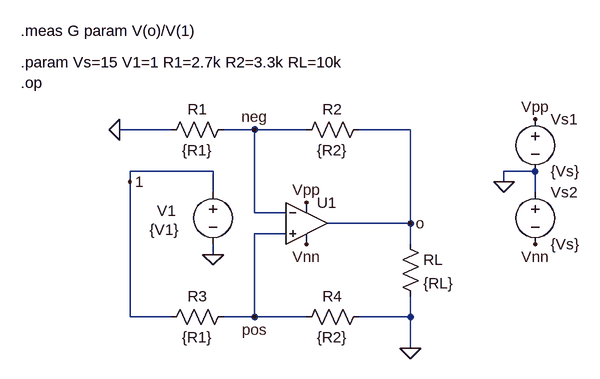
[diagram p0: schematic Amp05op.asc]
Amp05op.asc, the LTspice schematic file:
Version 4
SHEET 1 968 680
WIRE -48 80 -128 80
WIRE 80 80 32 80
WIRE 160 80 80 80
WIRE 320 80 240 80
WIRE 16 144 -112 144
WIRE 512 144 464 144
WIRE -112 160 -112 144
WIRE 464 160 464 144
WIRE 16 176 16 144
WIRE 512 176 512 144
WIRE 80 208 80 80
WIRE 128 208 80 208
WIRE 320 224 320 80
WIRE 320 224 192 224
WIRE 128 240 80 240
WIRE 320 256 320 224
WIRE 16 272 16 256
WIRE -112 368 -112 160
WIRE -48 368 -112 368
WIRE 80 368 80 240
WIRE 80 368 32 368
WIRE 160 368 80 368
WIRE 320 368 320 336
WIRE 320 368 240 368
WIRE 320 416 320 368
FLAG 512 64 Vpp
FLAG 464 160 0
FLAG 512 256 Vnn
FLAG 320 416 0
FLAG 160 192 Vpp
FLAG 160 256 Vnn
FLAG 16 272 0
FLAG 320 224 o
FLAG 80 80 neg
FLAG 80 368 pos
FLAG -112 160 1
FLAG -128 80 0
SYMBOL voltage 512 48 R0
WINDOW 123 0 0 Left 0
WINDOW 39 0 0 Left 0
SYMATTR InstName Vs1
SYMATTR Value {Vs}
SYMBOL voltage 512 160 R0
WINDOW 123 0 0 Left 0
WINDOW 39 0 0 Left 0
SYMATTR InstName Vs2
SYMATTR Value {Vs}
SYMBOL res 304 240 R0
SYMATTR InstName RL
SYMATTR Value {RL}
SYMBOL voltage 16 160 R0
WINDOW 3 -98 74 Left 2
WINDOW 123 0 0 Left 0
WINDOW 39 0 0 Left 0
WINDOW 0 -86 45 Left 2
SYMATTR Value {V1}
SYMATTR InstName V1
SYMBOL Opamps\\UniversalOpamp2 160 224 R0
SYMATTR InstName U1
SYMBOL res -64 96 R270
WINDOW 0 32 56 VTop 2
WINDOW 3 0 56 VBottom 2
SYMATTR InstName R1
SYMATTR Value {R1}
SYMBOL res 144 96 R270
WINDOW 0 32 56 VTop 2
WINDOW 3 0 56 VBottom 2
SYMATTR InstName R2
SYMATTR Value {R2}
SYMBOL res -64 384 R270
WINDOW 0 32 56 VTop 2
WINDOW 3 0 56 VBottom 2
SYMATTR InstName R3
SYMATTR Value {R1}
SYMBOL res 144 384 R270
WINDOW 0 32 56 VTop 2
WINDOW 3 0 56 VBottom 2
SYMATTR InstName R4
SYMATTR Value {R2}
TEXT -280 -24 Left 2 !.param Vs=15 V1=1 R1=2.7k R2=3.3k RL=10k
TEXT -280 8 Left 2 !.op
TEXT -280 -72 Left 2 !.meas G param V(o)/V(1)

The netlist it stands for:
* Amp05op.asc
Vs1 Vpp 0 {Vs}
Vs2 0 Vnn {Vs}
RL o 0 {RL}
V1 1 0 {V1}
XU1 pos neg Vpp Vnn o level.2 Avol=1Meg GBW=10Meg Slew=10Meg ilimit=25m rail=0 Vos=0 phimargin=45 en=0 enk=0 in=0 ink=0 Rin=500Meg  ; pins IN+ IN- V+ V- OUT
R1 0 neg {R1}
R2 neg o {R2}
R3 1 pos {R1}
R4 pos 0 {R2}
.param Vs=15 V1=1 R1=2.7k R2=3.3k RL=10k
.op
.meas G param V(o)/V(1)
.lib UniversalOpamps2.sub
.backanno
.end